# EAGLE design sashwat-mc-one-smd (EAGLE 9.6.2)
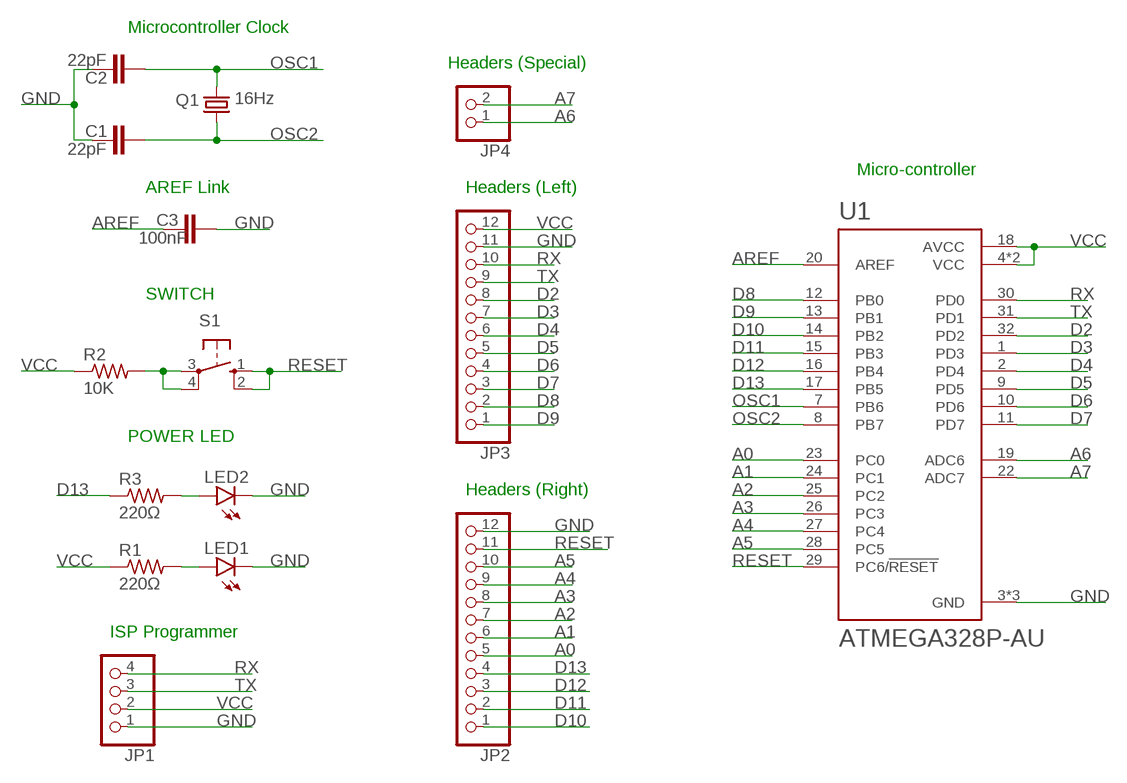
[diagram p0: schematic, sheet 1]

## Parts
C1  22pF  C-EUC0805  [C0805]
C2  22pF  C-EUC0805  [C0805]
C3  100nF  C-EUC0805  [C0805]
JP1  PINHD-1X4  [1X04]
JP2  PINHD-1X12  [1X12]
JP3  PINHD-1X12  [1X12]
JP4  PINHD-1X2  [1X02]
LED1  LEDCHIPLED_0805  [CHIPLED_0805]
LED2  LEDCHIPLED_0805  [CHIPLED_0805]
Q1  16Hz  CRYSTALHC49S  [HC49/S]
R1  220Ω  R-US_R0805  [R0805]
R2  10K  R-US_R0805  [R0805]
R3  220Ω  R-US_R0805  [R0805]
S1  10-XX  [B3F-10XX]
U1  ATMEGA328P-AU  [QFP80P900X900X120-32N]

## Nets
A0: JP2.5 U1.23(PC0)
A1: JP2.6 U1.24(PC1)
A2: JP2.7 U1.25(PC2)
A3: JP2.8 U1.26(PC3)
A4: JP2.9 U1.27(PC4)
A5: JP2.10 U1.28(PC5)
A6: JP4.1 U1.19(ADC6)
A7: JP4.2 U1.22(ADC7)
AREF: C3.2 U1.20(AREF)
D2: JP3.8 U1.32(PD2)
D3: JP3.7 U1.1(PD3)
D4: JP3.6 U1.2(PD4)
D5: JP3.5 U1.9(PD5)
D6: JP3.4 U1.10(PD6)
D7: JP3.3 U1.11(PD7)
D8: JP3.2 U1.12(PB0)
D9: JP3.1 U1.13(PB1)
D10: JP2.1 U1.14(PB2)
D11: JP2.2 U1.15(PB3)
D12: JP2.3 U1.16(PB4)
D13: JP2.4 R3.1 U1.17(PB5)
GND: C1.2 C2.2 C3.1 JP1.1 JP2.12 JP3.11 LED1.C LED2.C U1.3(GND) U1.5(GND) U1.21(GND)
N$1: LED2.A R3.2
N$2: LED1.A R1.2
N$4: R2.2 S1.3(P) S1.4(P1)
OSC1: C2.1 Q1.2 U1.7(PB6)
OSC2: C1.1 Q1.1 U1.8(PB7)
RESET: JP2.11 S1.1(S) S1.2(S1) U1.29(PC6/!RESET)
RX: JP1.4 JP3.10 U1.30(PD0)
TX: JP1.3 JP3.9 U1.31(PD1)
VCC: JP1.2 JP3.12 R1.1 R2.1 U1.4(VCC) U1.6(VCC) U1.18(AVCC)

## Notes on the sheet
- Microcontroller Clock
- Headers (Special)
- Micro-controller
- AREF Link | Headers (Left)
- SWITCH
- POWER LED
- Headers (Right)
- ISP Programmer

## Library data of the parts
C1-C3 = rcl:C-EU: CAPACITOR, European symbol; SPICEPREFIX: C
JP1 = pinhead:PINHD-1X4: PIN HEADER
JP2 JP3 = pinhead:PINHD-1X12: PIN HEADER
JP4 = pinhead:PINHD-1X2: PIN HEADER
LED1 LED2 = led:LED: LED OSRAM: - CHIPLED LG R971, LG N971, LY N971, LG Q971, LY Q971, LO R971, LY R971 LH N974, LH R974 LS Q976, LO Q976, LY Q976 LO Q996 - Hyper CHIPLED LW Q18S LB Q993, LB Q99A, LB R99A - SideLED LS A670, LO A670, LY A670, LG A670, LP A670 LB A673, LV A673, LT A673, LW A673 LH A674 LY A675 LS A676, LA A676, LO A676, LY A676, LW A676 LS A679, LY A679, LG A679 - Hyper Micro SIDELED® LS Y876, LA Y876, LO Y876, LY Y876 LT Y87S - SmartLED LW L88C, LW L88S LB L89C, LB L89S, LG L890 LS L89K, LO L89K, LY L89K LS L896, LA L896, LO L896, LY L896 - TOPLED LS T670, LO T670, LY T670, LG T670, LP T670 LSG T670, LSP T670, LSY T670, LOP T670, LYG T670 LG T671, LOG T671, LSG T671 LB T673, LV T673, LT T673, LW T673 LH T674 LS T676, LA T676, LO T676, LY T676, LB T676, LH T676, LSB T676, LW T676 LB T67C, LV T67C, LT T67C, LS T67K, LO T67K, LY T67K, LW E67C LS E67B, LA E67B, LO E67B, LY E67B, LB E67C, LV E67C, LT E67C LW T67C LS T679, LY T679, LG T679 LS T770, LO T770, LY T770, LG T770, LP T770 LB T773, LV T773, LT T773, LW T773 LH T774 LS E675, LA E675, LY E675, LS T675 LS T776, LA T776, LO T776, LY T776, LB T776 LHGB T686 LT T68C, LB T68C - Hyper Mini TOPLED® LB M676 - Mini TOPLED Santana® LG M470 LS M47K, LO M47K, LY M47K Source: http://www.osram.convergy.de LUXEON: - LUMILED® LXK2-PW12-R00, LXK2-PW12-S00, LXK2-PW14-U00, LXK2-PW14-V00 LXK2-PM12-R00, LXK2-PM12-S00, LXK2-PM14-U00 LXK2-PE12-Q00, LXK2-PE12-R00, LXK2-PE12-S00, LXK2-PE14-T00, LXK2-PE14-U00 LXK2-PB12-K00, LXK2-PB12-L00, LXK2-PB12-M00, LXK2-PB14-N00, LXK2-PB14-P00, LXK2-PB14-Q00 LXK2-PR12-L00, LXK2-PR12-M00, LXK2-PR14-Q00, LXK2-PR14-R00 LXK2-PD12-Q00, LXK2-PD12-R00, LXK2-PD12-S00 LXK2-PH12-R00, LXK2-PH12-S00 LXK2-PL12-P00, LXK2-PL12-Q00, LXK2-PL12-R00 Source: www.luxeon.com KINGBRIGHT: KA-3528ASYC Source: www.kingbright.com
Q1 = crystal:CRYSTAL: CRYSTAL; OC_FARNELL: 1667008; OC_NEWARK: unknown
R1-R3 = resistor:R-US_: RESISTOR, American symbol
S1 = switch-omron:10-XX: OMRON SWITCH; MPN: B3F-1000; OC_FARNELL: 176432; OC_NEWARK: 36M3542
U1 = ATMEGA328P-AU:ATMEGA328P-AU: ATmega Series 20 MHz 32 KB Flash 2 KB SRAM 8-Bit Microcontroller - TQFP-32 Check prices <https://pricing.snapeda.com/parts/ATMEGA328P-AU/Microchip%20Technology/view-part?ref=eda>; AVAILABILITY: In Stock; DESCRIPTION: AVR AVR® ATmega Microcontroller IC 8-Bit 20MHz 32KB (16K x 16) FLASH 32-TQFP (7x7); MF: Microchip Technology; MP: ATMEGA328P-AU; PACKAGE: TQFP-32 Microchip; PRICE: None

## Board
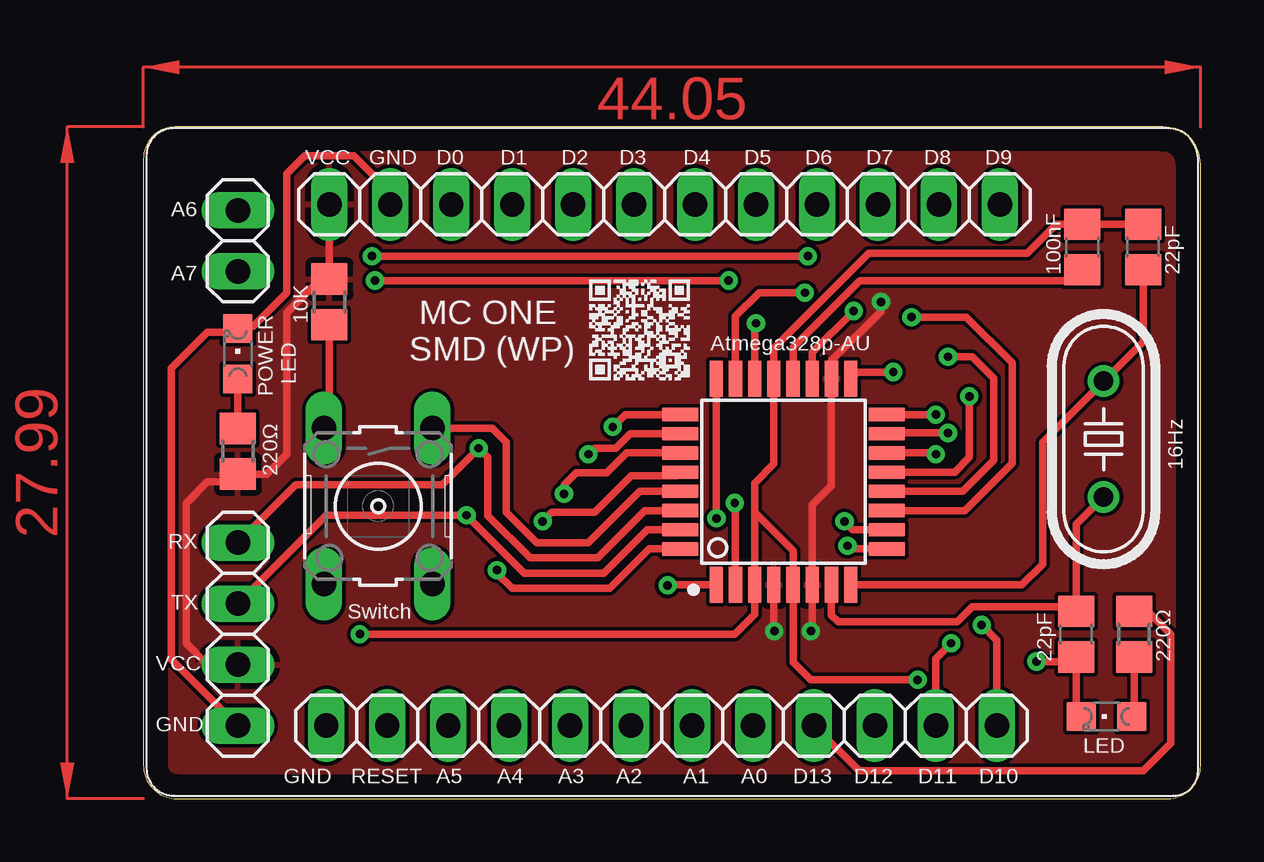
[diagram p1: board, top side]
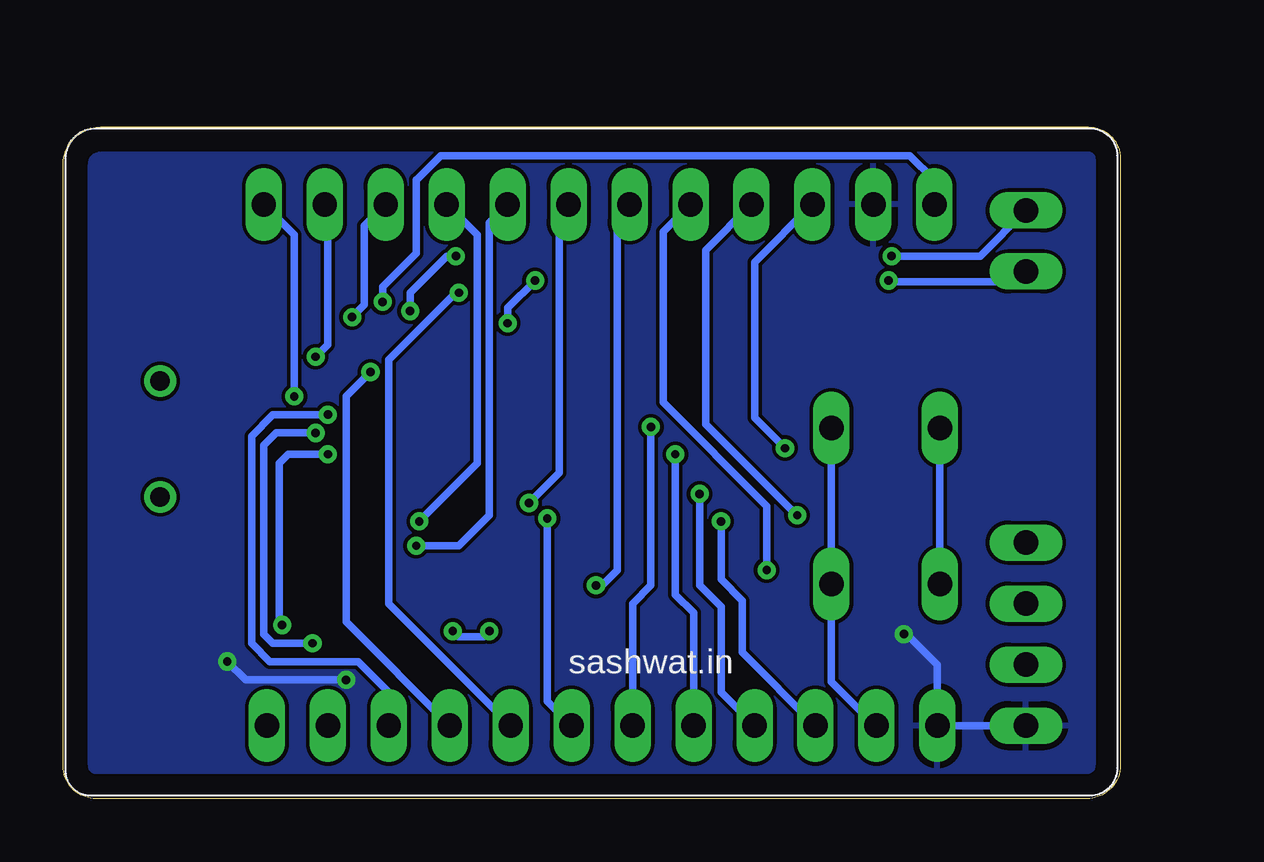
[diagram p2: board, bottom side, seen from below]

Size 44.05 x 27.99 mm. Coordinates in mm from the lower left corner, seen from the top.
Outline: 0,26.67 0,1.4 arc90 1.4,0 42.67,0 arc90 44.05,1.38 44.05,26.44 arc90 42.49,27.99 1.32,27.99 arc90 0,26.67
Copper layers (1*16): Top 0.035mm / dielectric 1.5mm / Bottom 0.035mm
Design rules "default": minimum track width 6mil, minimum drill 0.35mm, track to track 6mil, track to pad 6mil, pad to pad 6mil, via to via 6mil, smd to smd 6mil, copper to edge 40mil, drill to drill 6mil, minimum pad ring 10mil, minimum via ring 8mil, stop-mask expansion 4mil, vias tented up to drill 0mil, thermal gap 10mil

### Footprints (pad centres in the part's own frame; a part is rotated, then mirrored left to right if it is on the bottom)
C0805 = smd 1.3 x 1.5: 1 -0.95,0; 2 0.95,0
1X04 = drill 1.016 long: 1 -3.81,0; 2 -1.27,0; 3 1.27,0; 4 3.81,0
1X12 = drill 1.016 long: 1 -13.97,0; 2 -11.43,0; 3 -8.89,0; 4 -6.35,0; 5 -3.81,0; 6 -1.27,0; 7 1.27,0; 8 3.81,0; 9 6.35,0; 10 8.89,0; 11 11.43,0; 12 13.97,0
1X02 = drill 1.016 long: 1 -1.27,0; 2 1.27,0
CHIPLED_0805 = smd 1.2 x 1.2: A 0,-1.05; C 0,1.05
HC49/S = drill 0.813: 1 -2.413,0; 2 2.413,0
R0805 = smd 1.3 x 1.5: 1 -0.95,0; 2 0.95,0
B3F-10XX = drill 1.016 long: 1 -3.251,2.261; 2 3.251,2.261; 3 -3.251,-2.261; 4 3.251,-2.261
QFP80P900X900X120-32N = smd 1.5 x 0.55: 1 -4.3,2.8; 2 -4.3,2; 3 -4.3,1.2; 4 -4.3,0.4; 5 -4.3,-0.4; 6 -4.3,-1.2; 7 -4.3,-2; 8 -4.3,-2.8; 17 4.3,-2.8; 18 4.3,-2; 19 4.3,-1.2; 20 4.3,-0.4; 21 4.3,0.4; 22 4.3,1.2; 23 4.3,2; 24 4.3,2.8 | smd 0.55 x 1.5: 9 -2.8,-4.3; 10 -2,-4.3; 11 -1.2,-4.3; 12 -0.4,-4.3; 13 0.4,-4.3; 14 1.2,-4.3; 15 2,-4.3; 16 2.8,-4.3; 25 2.8,4.3; 26 2,4.3; 27 1.2,4.3; 28 0.4,4.3; 29 -0.4,4.3; 30 -1.2,4.3; 31 -2,4.3; 32 -2.8,4.3

### Placement (x,y rotation side)
C1  41.66,22.99 90 top
C2  38.86,6.86 270 top
C3  39.12,22.99 270 top
JP1  3.94,6.86 90 top
JP2  21.59,3.05 180 top
JP3  21.72,24.77 180 top
JP4  3.94,23.24 270 top
LED1  3.94,18.54 0 top
LED2  40.13,3.43 90 top
Q1  40.01,14.99 270 top
R1  3.94,14.48 90 top
R2  7.75,20.7 270 top
R3  41.28,6.86 270 top
S1  9.78,12.19 270 top
U1  26.67,13.21 90 top

### Tracks (layer width: path | path; a pad name or v marks a point on that pad's centre or on a via)
A0  (via drill 0.35)
  Top 0.305: U1.23 24.67,20.1 25.65,21.08 v27.56,21.08
  Bottom 0.305: JP2.5 30.48,8.13 30.48,18.29 27.69,21.08 v27.56,21.08
A1  (via drill 0.35)
  Top 0.305: U1.24 23.87,13.59 | 23.88,13.59 23.87,13.59 | 23.87,13.59 v23.87,11.69 v23.88,11.68
  Bottom 0.305: v23.88,11.68 23.88,4.06 JP2.6
A2  (via drill 0.35)
  Top 0.305: U1.25 20.07,16.01 v19.56,15.49
  Bottom 0.305: JP2.7 20.32,8.13 19.56,8.89 v19.56,15.49
A3  (via drill 0.35)
  Top 0.305: U1.26 20.29,15.21 19.68,14.6 18.8,14.6 v18.54,14.35
  Bottom 0.305: JP2.8 17.78,7.75 18.54,8.51 v18.54,14.35
A4  (via drill 0.35)
  Top 0.305: v17.53,12.7 17.53,13.08 18.03,13.59 19.3,13.59 19.86,14.15 19.87,14.15 20.13,14.41 U1.27
  Bottom 0.305: JP2.9 16.64,4.44 16.64,8 17.53,8.89 v17.53,12.7
A5  (via drill 0.35)
  Top 0.305: U1.28 22.22,13.46 20.32,13.46 18.8,11.94 17.02,11.94 v16.64,11.56
  Bottom 0.305: JP2.10 15.75,6.1 15.75,8.25 16.64,9.14 v16.64,11.56
A6  (via drill 0.35)
  Top 0.305: v29.59,20.32 27.87,18.6 U1.19 | v27.69,22.61 v9.53,22.61
  Bottom 0.305: v29.59,20.32 29.59,21.08 28.07,22.61 v27.69,22.61 | v9.53,22.61 5.84,22.61 JP4.1
A7  (via drill 0.35)
  Top 0.305: U1.22 25.47,19.75 v25.53,19.81 | v24.38,21.59 v9.65,21.59
  Bottom 0.305: v9.65,21.59 9.6,21.54 4.37,21.54 JP4.2 | v25.53,19.81 25.53,20.45 v24.38,21.59
AREF
  Top 0.305: C3.2 38.67,21.59 29.84,21.59 27.07,18.81 U1.20
D2  (via drill 0.35)
  Top 0.305: U1.32 21.08,10.41 19.43,8.76 15.37,8.76 14.73,9.4 v14.73,9.52
  Bottom 0.305: JP3.8 19.05,23.62 19.05,16.51 14.73,12.19 v14.73,9.52
D3  (via drill 0.35)
  Top 0.305: U1.1 21.86,8.91 v21.84,8.89
  Bottom 0.305: v21.84,8.89 21.59,8.89 20.95,9.52 20.95,24.26 JP3.7
D4  (via drill 0.35)
  Top 0.305: U1.2 24.67,12.29 v24.64,12.32
  Bottom 0.305: JP3.6 23.37,24.38 23.37,13.59 v24.64,12.32
D5  (via drill 0.35)
  Top 0.305: U1.9 29.47,10.41 v29.34,10.54
  Bottom 0.305: JP3.5 26.29,24 26.29,11.81 27.56,10.54 v29.34,10.54
D6  (via drill 0.35)
  Top 0.305: U1.10 29.56,11.21 v29.21,11.56
  Bottom 0.305: JP3.4 26.8,23.49 26.8,13.97 v29.21,11.56
D7  (via drill 0.35)
  Top 0.305: U1.11 34.23,12.01 36.2,13.97 36.2,18.16 34.29,20.07 v32,20.07
  Bottom 0.305: JP3.3 31.5,23.88 31.5,20.57 v32,20.07
D8  (via drill 0.35)
  Top 0.305: U1.12 34.14,12.81 35.43,14.1 35.43,17.53 34.54,18.41 v33.53,18.41
  Bottom 0.305: JP3.2 33.02,24.64 33.02,18.92 v33.53,18.41
D9  (via drill 0.35)
  Top 0.305: U1.13 33.8,13.61 34.42,14.22 v34.42,16.76
  Bottom 0.305: v34.42,16.76 34.42,23.49 JP3.1
D10  (via drill 0.35)
  Top 0.305: U1.14 32.96,14.41 v33.02,14.35 | v34.93,7.24 35.56,6.6 JP2.1
  Bottom 0.305: v33.02,14.35 34.67,14.35 35.05,13.97 35.05,7.37 v34.93,7.24
D11  (via drill 0.35)
  Top 0.305: U1.15 31,15.24 v33.53,15.24 | v33.66,6.48 33.02,5.84 JP2.2
  Bottom 0.305: v33.66,6.48 35.31,6.48 35.69,6.86 35.69,14.73 35.18,15.24 v33.53,15.24
D12  (via drill 0.35)
  Top 0.305: U1.16 v33.01,16.01 v33.02,16
  Bottom 0.305: JP2.3 30.48,4.44 31.75,5.71 35.43,5.71 36.2,6.48 36.2,15.11 35.31,16 v33.02,16
D13  (via drill 0.35)
  Top 0.305: U1.17 29.74,17.78 v31.24,17.78 | JP2.4 29.82,1.17 41.66,1.17 42.8,2.31 42.8,6.86 41.85,7.81 R3.1
  Bottom 0.305: JP2.4 32.26,7.37 32.26,16.76 v31.24,17.78
GND  (via drill 0.35)
  Top 0.305: 25.47,11.94 U1.3 25.47,7.69 24.64,6.86 v9.02,6.86 | 25.47,11.94 25.47,13.15 26.27,13.95 U1.21 26.27,18.78 30.23,22.73 36.83,22.73 38.03,23.94 C3.1 C1.2 | 25.47,11.94 27.07,10.34 U1.5 27.07,5.7 27.81,4.95 v32.26,4.95 | JP3.11 10.29,25.27 8.76,26.8 6.73,26.8 5.97,26.03 5.97,21.08 4.57,19.68 4.03,19.68 LED1.C 3.78,19.43 2.67,19.43 1.17,17.93 1.17,5.82 JP1.1 | LED2.C 38.86,3.65 C2.2 38.67,5.71 v37.21,5.71
  Bottom 0.305: v9.02,6.86 8.89,6.86 7.62,5.59 JP2.12 JP1.1 | v32.26,4.95 36.45,4.95 v37.21,5.71
  pour Bottom: 1.14,27.81 42.8,27.81 arc-90 43.94,26.67 43.94,1.27 arc-90 42.8,0.13 1.27,0.13 arc-90 0.13,1.27 0.13,26.8 arc-90
N$1
  Top 0.305: R3.2 41.28,3.52 LED2.A
N$2
  Top 0.305: R1.2 LED1.A
N$4
  Top 0.305: R2.2 7.75,15.67 S1.3
  Bottom 0.305: S1.3 S1.4
OSC1
  Top 0.305: Q1.2 38.86,11.43 C2.1 38.67,8 34.54,8 33.91,7.37 28.96,7.37 28.67,7.65 U1.7
OSC2
  Top 0.305: C1.1 41.66,19.05 Q1.1 37.47,14.86 37.47,9.78 36.59,8.91 U1.8
RESET
  Top 0.305: U1.29 20.68,12.81 18.54,10.67 16.38,10.67 15.11,11.94 15.11,14.86 14.53,15.44 S1.1
  Bottom 0.305: JP2.11 10.21,3.05 12.04,4.88 S1.2 S1.1
RX  (via drill 0.35)
  Top 0.305: U1.30 20.9,12.01 18.92,10.03 16.12,10.03 14.35,11.8 14.35,14.22 v13.97,14.6 12.45,13.08 6.35,13.08 JP1.4
  Bottom 0.305: JP3.10 15.24,22.35 15.24,15.87 v13.97,14.6
TX  (via drill 0.35)
  Top 0.305: U1.31 20.99,11.21 19.18,9.4 15.88,9.4 v13.46,11.81 7.62,11.81 JP1.3
  Bottom 0.305: v13.46,11.81 13.49,11.81 17.27,15.6 17.27,22.86 JP3.9
VCC  (via drill 0.35)
  Top 0.305: JP3.12 R2.1 7.37,21.65 5.97,20.25 5.97,14.35 5.15,13.53 R1.1 3.62,13.21 2.67,13.21 1.78,12.32 1.78,6.48 2.67,5.59 JP1.2 | v26.29,6.98 26.27,7 U1.4 | v27.81,6.98 27.87,7.04 U1.6 27.87,12.25 28.67,13.05 U1.18 28.67,18.26 30.73,20.32 v30.73,20.7
  Bottom 0.305: v30.73,20.7 30.73,21.34 29.34,22.73 29.34,25.77 | 29.34,25.77 29.34,25.78 | 29.34,25.77 28.31,26.8 8.76,26.8 7.75,25.78 JP3.12 | v27.81,6.98 27.58,6.76 26.52,6.76 v26.29,6.98
  pour Top: 1.27,27.81 arc90 0.13,26.67 0.13,1.27 arc90 1.27,0.13 42.93,0.13 arc90 43.94,1.14 43.94,26.54 arc90 42.67,27.81
(copper drawn outside any net)
  shapes: Top area x2

### Text on the board
tPlace: VCC | GND | D0 | D1 | D2 | D3 | D4 | D5 | D6 | D7 | D8 | D9 | A6 | A7 | 100nF | 22pF | 10K | Atmega328p-AU | MC ONE / SMD (WP) | POWER / LED | 16Hz | 220Ω | RX | TX | Switch | 22pF | 220Ω | VCC | GND | LED | GND | RESET | A5 | A4 | A3 | A2 | A1 | A0 | D13 | D12 | D11 | D10
bPlace: sashwat.in